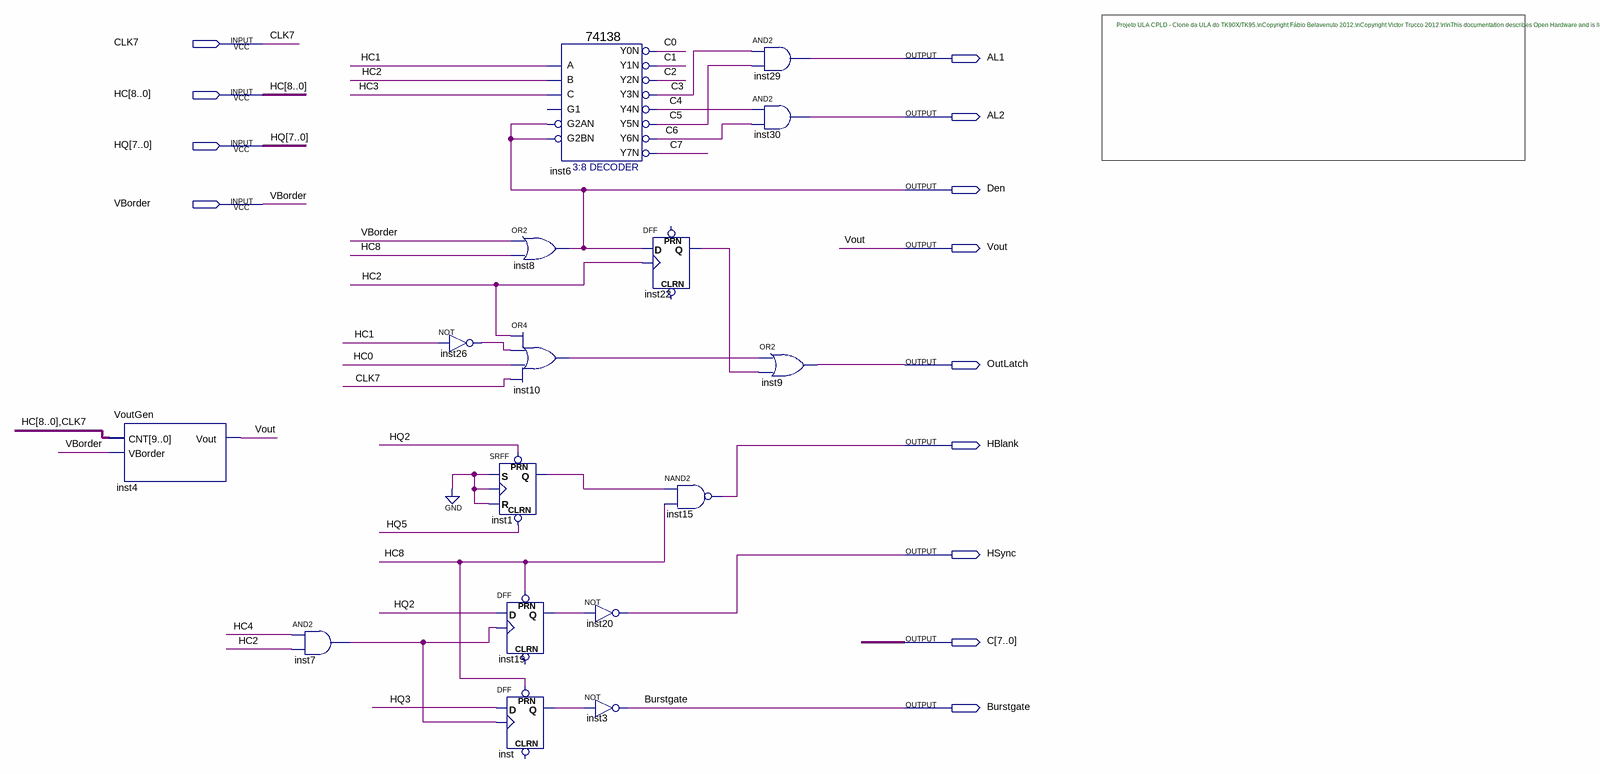
[diagram p0: schematic sheet]
// Quartus schematic HSync_Blank.bdf as structural Verilog: 16 symbols, 13 pins
module HSync_Blank (
  input  CLK7,
  input  [8:0] HC,
  input  [7:0] HQ,
  input  VBorder,
  output AL1,
  output AL2,
  output Den,
  output Vout,
  output OutLatch,
  output HBlank,
  output HSync,
  output [7:0] C,
  output Burstgate
);

  wire inst1_q, inst7_out, inst10_out, inst19_q, inst22_q, inst26_out, inst_q;

  VoutGen inst4 (.CNT({HC, CLK7}), .VBorder(VBorder), .Vout(Vout));
  and inst7 (inst7_out, HC[4], HC[2]);
  not inst26 (inst26_out, HC[1]);
  or inst8 (Den, VBorder, HC[8]);
  or inst10 (inst10_out, HC[2], inst26_out, HC[0], CLK7);
  SRFF inst1 (.PRN(HQ[2]), .CLRN(HQ[5]), .S(1'b0), .R(1'b0), .CLK(1'b0), .Q(inst1_q));
  DFF inst19 (.CLK(inst7_out), .D(HQ[2]), .PRN(HC[8]), .Q(inst19_q));  // open: CLRN
  DFF inst (.CLK(inst7_out), .D(HQ[3]), .PRN(HC[8]), .Q(inst_q));  // open: CLRN
  \74138  inst6 (
    .A(HC[1]), .B(HC[2]), .C(HC[3]), .G2AN(Den), .G2BN(Den), .Y0N(C[0]), .Y1N(C[1]), .Y2N(C[2]), .Y3N(C[3]),
    .Y4N(C[4]), .Y5N(C[5]), .Y6N(C[6]), .Y7N(C[7]));  // open: G1
  not inst20 (HSync, inst19_q);
  not inst3 (Burstgate, inst_q);
  DFF inst22 (.CLK(HC[2]), .D(Den), .Q(inst22_q));  // open: CLRN, PRN
  nand inst15 (HBlank, inst1_q, HC[8]);
  and inst29 (AL1, C[3], C[5]);
  and inst30 (AL2, C[4], C[6]);
  or inst9 (OutLatch, inst10_out, inst22_q);

  // Notes on the sheet:
  //   Projeto ULA CPLD - Clone da ULA do TK90X/TK95.\nCopyright Fábio Belavenuto 2012.\nCopyright Victor Trucco 2012.\n\nThis documentation describes Open Hardware and is licensed under the CERN OHL v. 1.1.\nYou may redistribute and modify this documentation under the terms of the\nCERN OHL v.1.1. (http://ohwr.org/cernohl). This documentation is distributed\nWITHOUT ANY EXPRESS OR IMPLIED WARRANTY, INCLUDING OF MERCHANTABILITY,\nSATISFACTORY QUALITY AND FITNESS FOR A PARTICULAR PURPOSE.\nPlease see the CERN OHL v.1.1 for applicable conditions
endmodule
